# EAGLE design SparkFun_quadstep-v11assembly (EAGLE 5.06)
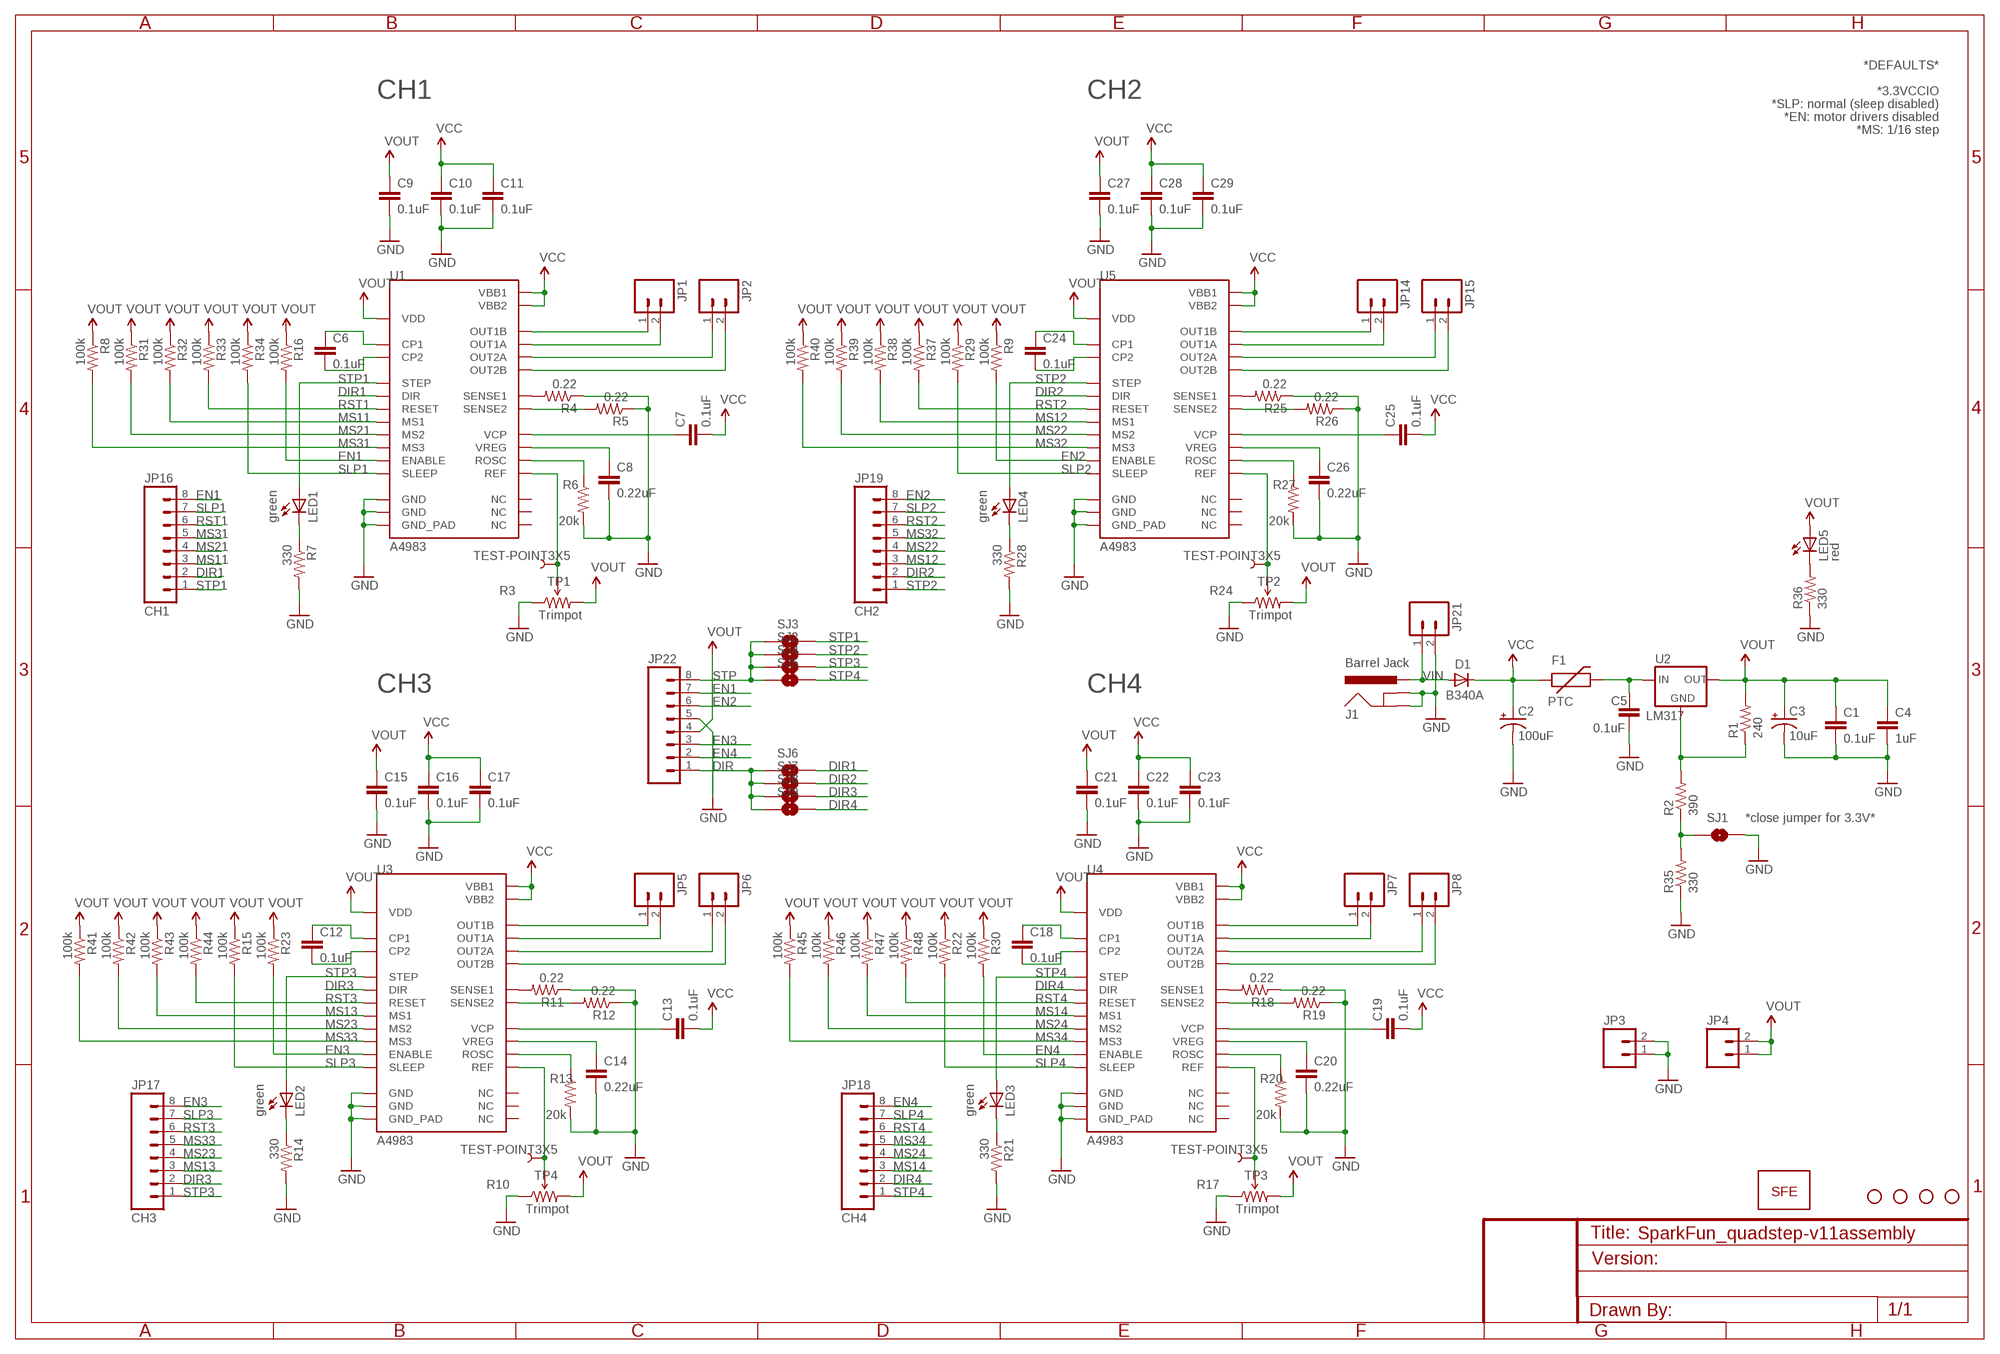
[diagram p0: schematic, sheet 1]

## Parts
C1  0.1uF  CAP0402-CAP  [0402-CAP]
C2  100uF  CAP_POLG  [PANASONIC_G]
C3  10uF  CAP_POL1206  [EIA3216]
C4  1uF  CAP0805  [0805]
C5  0.1uF  CAP0402-CAP  [0402-CAP]
C6  0.1uF  CAP0402-CAP  [0402-CAP]
C7  0.1uF  CAP0402-CAP  [0402-CAP]
C8  0.22uF  CAP0402-CAP  [0402-CAP]
C9  0.1uF  CAP0402-CAP  [0402-CAP]
C10  0.1uF  CAP0402-CAP  [0402-CAP]
C11  0.1uF  CAP0402-CAP  [0402-CAP]
C12  0.1uF  CAP0402-CAP  [0402-CAP]
C13  0.1uF  CAP0402-CAP  [0402-CAP]
C14  0.22uF  CAP0402-CAP  [0402-CAP]
C15  0.1uF  CAP0402-CAP  [0402-CAP]
C16  0.1uF  CAP0402-CAP  [0402-CAP]
C17  0.1uF  CAP0402-CAP  [0402-CAP]
C18  0.1uF  CAP0402-CAP  [0402-CAP]
C19  0.1uF  CAP0402-CAP  [0402-CAP]
C20  0.22uF  CAP0402-CAP  [0402-CAP]
C21  0.1uF  CAP0402-CAP  [0402-CAP]
C22  0.1uF  CAP0402-CAP  [0402-CAP]
C23  0.1uF  CAP0402-CAP  [0402-CAP]
C24  0.1uF  CAP0402-CAP  [0402-CAP]
C25  0.1uF  CAP0402-CAP  [0402-CAP]
C26  0.22uF  CAP0402-CAP  [0402-CAP]
C27  0.1uF  CAP0402-CAP  [0402-CAP]
C28  0.1uF  CAP0402-CAP  [0402-CAP]
C29  0.1uF  CAP0402-CAP  [0402-CAP]
D1  B340A  DIODESMA  [SMA-DIODE]
F1  PTC  PTCSMD  [PTC-1206]
J1  Barrel Jack  POWER_JACKSMD  [POWER_JACK_SMD]
JP1  M023.5MM_LOCK  [SCREWTERMINAL-3.5MM-2_LOCK]
JP2  M023.5MM_LOCK  [SCREWTERMINAL-3.5MM-2_LOCK]
JP3  M02PTH  [1X02]
JP4  M02PTH  [1X02]
JP5  M023.5MM_LOCK  [SCREWTERMINAL-3.5MM-2_LOCK]
JP6  M023.5MM_LOCK  [SCREWTERMINAL-3.5MM-2_LOCK]
JP7  M023.5MM_LOCK  [SCREWTERMINAL-3.5MM-2_LOCK]
JP8  M023.5MM_LOCK  [SCREWTERMINAL-3.5MM-2_LOCK]
JP9  STAND-OFF  [STAND-OFF]
JP10  STAND-OFF  [STAND-OFF]
JP11  STAND-OFF  [STAND-OFF]
JP12  STAND-OFF  [STAND-OFF]
JP14  M023.5MM_LOCK  [SCREWTERMINAL-3.5MM-2_LOCK]
JP15  M023.5MM_LOCK  [SCREWTERMINAL-3.5MM-2_LOCK]
JP16  CH1  M08  [1X08]
JP17  CH3  M08  [1X08]
JP18  CH4  M08  [1X08]
JP19  CH2  M08  [1X08]
JP20  LOGO-SFENEW  [SFE-NEW-WEBLOGO]
JP21  M02PTH  [1X02]
JP22  M08  [1X08]
LED1  green  LED0603  [LED-0603]
LED2  green  LED0603  [LED-0603]
LED3  green  LED0603  [LED-0603]
LED4  green  LED0603  [LED-0603]
LED5  red  LED0603  [LED-0603]
R1  240  RESISTOR0402-RES  [0402-RES]
R2  390  RESISTOR0402-RES  [0402-RES]
R3  Trimpot  TRIMPOTSMD  [TRIMPOT-3MM]
R4  0.22  RESISTOR0805-RES  [0805]
R5  0.22  RESISTOR0805-RES  [0805]
R6  20k  RESISTOR0402-RES  [0402-RES]
R7  330  RESISTOR0402-RES  [0402-RES]
R8  100k  RESISTOR0402-RES  [0402-RES]
R9  100k  RESISTOR0402-RES  [0402-RES]
R10  Trimpot  TRIMPOTSMD  [TRIMPOT-3MM]
R11  0.22  RESISTOR0805-RES  [0805]
R12  0.22  RESISTOR0805-RES  [0805]
R13  20k  RESISTOR0402-RES  [0402-RES]
R14  330  RESISTOR0402-RES  [0402-RES]
R15  100k  RESISTOR0402-RES  [0402-RES]
R16  100k  RESISTOR0402-RES  [0402-RES]
R17  Trimpot  TRIMPOTSMD  [TRIMPOT-3MM]
R18  0.22  RESISTOR0805-RES  [0805]
R19  0.22  RESISTOR0805-RES  [0805]
R20  20k  RESISTOR0402-RES  [0402-RES]
R21  330  RESISTOR0402-RES  [0402-RES]
R22  100k  RESISTOR0402-RES  [0402-RES]
R23  100k  RESISTOR0402-RES  [0402-RES]
R24  Trimpot  TRIMPOTSMD  [TRIMPOT-3MM]
R25  0.22  RESISTOR0805-RES  [0805]
R26  0.22  RESISTOR0805-RES  [0805]
R27  20k  RESISTOR0402-RES  [0402-RES]
R28  330  RESISTOR0402-RES  [0402-RES]
R29  100k  RESISTOR0402-RES  [0402-RES]
R30  100k  RESISTOR0402-RES  [0402-RES]
R31  100k  RESISTOR0402-RES  [0402-RES]
R32  100k  RESISTOR0402-RES  [0402-RES]
R33  100k  RESISTOR0402-RES  [0402-RES]
R34  100k  RESISTOR0402-RES  [0402-RES]
R35  330  RESISTOR0402-RES  [0402-RES]
R36  330  RESISTOR0402-RES  [0402-RES]
R37  100k  RESISTOR0402-RES  [0402-RES]
R38  100k  RESISTOR0402-RES  [0402-RES]
R39  100k  RESISTOR0402-RES  [0402-RES]
R40  100k  RESISTOR0402-RES  [0402-RES]
R41  100k  RESISTOR0402-RES  [0402-RES]
R42  100k  RESISTOR0402-RES  [0402-RES]
R43  100k  RESISTOR0402-RES  [0402-RES]
R44  100k  RESISTOR0402-RES  [0402-RES]
R45  100k  RESISTOR0402-RES  [0402-RES]
R46  100k  RESISTOR0402-RES  [0402-RES]
R47  100k  RESISTOR0402-RES  [0402-RES]
R48  100k  RESISTOR0402-RES  [0402-RES]
SJ1  SOLDERJUMPERNO  [SJ_2S-NO]
SJ2  SOLDERJUMPERNO  [SJ_2S-NO]
SJ3  SOLDERJUMPERNO  [SJ_2S-NO]
SJ4  SOLDERJUMPERNO  [SJ_2S-NO]
SJ5  SOLDERJUMPERNO  [SJ_2S-NO]
SJ6  SOLDERJUMPERNO  [SJ_2S-NO]
SJ7  SOLDERJUMPERNO  [SJ_2S-NO]
SJ8  SOLDERJUMPERNO  [SJ_2S-NO]
SJ9  SOLDERJUMPERNO  [SJ_2S-NO]
TP1  TEST-POINT3X5  [PAD.03X.05]
TP2  TEST-POINT3X5  [PAD.03X.05]
TP3  TEST-POINT3X5  [PAD.03X.05]
TP4  TEST-POINT3X5  [PAD.03X.05]
U1  A4983  [QFN-28-5MM]
U2  LM317  V_REG_MC33269DT  [DPAK]
U3  A4983  [QFN-28-5MM]
U4  A4983  [QFN-28-5MM]
U5  A4983  [QFN-28-5MM]

## Nets
DIR: JP22.1 SJ6.1 SJ7.1 SJ8.1 SJ9.1
DIR1: JP16.2 SJ6.2 U1.P$19(DIR)
DIR2: JP19.2 SJ7.2 U5.P$19(DIR)
DIR3: JP17.2 SJ8.2 U3.P$19(DIR)
DIR4: JP18.2 SJ9.2 U4.P$19(DIR)
EN1: JP16.8 JP22.7 R16.2 U1.P$2(ENABLE)
EN2: JP19.8 JP22.6 R9.2 U5.P$2(ENABLE)
EN3: JP17.8 JP22.3 R23.2 U3.P$2(ENABLE)
EN4: JP18.8 JP22.2 R30.2 U4.P$2(ENABLE)
GND: C1.2 C2.- C3.C(-) C4.2 C5.2 C8.2 C9.2 C10.2 C11.2 C14.2 C15.2 C16.2 C17.2 C20.2 C21.2 C22.2 C23.2 C26.2 C27.2 C28.2 C29.2 J1.GND(GNDBREAK) J1.P$4(GND) JP3.1 JP3.2 JP21.2 JP22.5 R3.1(CCW) R4.1 R5.1 R6.2 R7.2 R10.1(CCW) R11.1 R12.1 R13.2 R14.2 R17.1(CCW) R18.1 R19.1 R20.2 R21.2 R24.1(CCW) R25.1 R26.1 R27.2 R28.2 R35.1 R36.1 SJ1.2 U1.P$3(GND) U1.P$18(GND) U1.P$29(GND_PAD) U3.P$3(GND) U3.P$18(GND) U3.P$29(GND_PAD) U4.P$3(GND) U4.P$18(GND) U4.P$29(GND_PAD) U5.P$3(GND) U5.P$18(GND) U5.P$29(GND_PAD)
MS11: JP16.3 R32.2 U1.P$9(MS1)
MS12: JP19.3 R38.2 U5.P$9(MS1)
MS13: JP17.3 R43.2 U3.P$9(MS1)
MS14: JP18.3 R47.2 U4.P$9(MS1)
MS21: JP16.4 R31.2 U1.P$10(MS2)
MS22: JP19.4 R39.2 U5.P$10(MS2)
MS23: JP17.4 R42.2 U3.P$10(MS2)
MS24: JP18.4 R46.2 U4.P$10(MS2)
MS31: JP16.5 R8.2 U1.P$11(MS3)
MS32: JP19.5 R40.2 U5.P$11(MS3)
MS33: JP17.5 R41.2 U3.P$11(MS3)
MS34: JP18.5 R45.2 U4.P$11(MS3)
N$1: R1.1 R2.2 U2.1(GND)
N$2: JP1.1 U1.P$21(OUT1B)
N$3: JP1.2 U1.P$24(OUT1A)
N$4: C5.1 F1.2 U2.3(IN)
N$6: JP2.1 U1.P$26(OUT2A)
N$7: JP2.2 U1.P$1(OUT2B)
N$8: R4.2 U1.P$23(SENSE1)
N$9: R5.2 U1.P$27(SENSE2)
N$10: C7.1 U1.P$6(VCP)
N$11: C8.1 U1.P$8(VREG)
N$12: R6.1 U1.P$13(ROSC)
N$13: C6.1 U1.P$4(CP1)
N$14: R3.2(WIPER) TP1.P$1 U1.P$17(REF)
N$15: C6.2 U1.P$5(CP2)
N$16: R11.2 U3.P$23(SENSE1)
N$17: LED1.C R7.1
N$18: R12.2 U3.P$27(SENSE2)
N$19: C13.1 U3.P$6(VCP)
N$20: C14.1 U3.P$8(VREG)
N$21: R13.1 U3.P$13(ROSC)
N$22: R10.2(WIPER) TP4.P$1 U3.P$17(REF)
N$23: C12.1 U3.P$4(CP1)
N$24: R2.1 R35.2 SJ1.1
N$25: C12.2 U3.P$5(CP2)
N$26: LED2.C R14.1
N$27: LED5.C R36.2
N$28: JP5.1 U3.P$21(OUT1B)
N$29: JP5.2 U3.P$24(OUT1A)
N$30: JP6.1 U3.P$26(OUT2A)
N$31: JP6.2 U3.P$1(OUT2B)
N$32: R18.2 U4.P$23(SENSE1)
N$33: R19.2 U4.P$27(SENSE2)
N$34: C19.1 U4.P$6(VCP)
N$35: C20.1 U4.P$8(VREG)
N$36: R20.1 U4.P$13(ROSC)
N$37: R17.2(WIPER) TP3.P$1 U4.P$17(REF)
N$38: C18.1 U4.P$4(CP1)
N$39: C18.2 U4.P$5(CP2)
N$40: LED3.C R21.1
N$41: JP7.1 U4.P$21(OUT1B)
N$42: JP7.2 U4.P$24(OUT1A)
N$43: JP8.1 U4.P$26(OUT2A)
N$44: JP8.2 U4.P$1(OUT2B)
N$45: R25.2 U5.P$23(SENSE1)
N$46: R26.2 U5.P$27(SENSE2)
N$47: C25.1 U5.P$6(VCP)
N$48: C26.1 U5.P$8(VREG)
N$49: R27.1 U5.P$13(ROSC)
N$50: R24.2(WIPER) TP2.P$1 U5.P$17(REF)
N$51: C24.1 U5.P$4(CP1)
N$52: C24.2 U5.P$5(CP2)
N$53: LED4.C R28.1
N$54: JP14.1 U5.P$21(OUT1B)
N$55: JP14.2 U5.P$24(OUT1A)
N$56: JP15.1 U5.P$26(OUT2A)
N$57: JP15.2 U5.P$1(OUT2B)
RST1: JP16.6 R33.2 U1.P$12(RESET)
RST2: JP19.6 R37.2 U5.P$12(RESET)
RST3: JP17.6 R44.2 U3.P$12(RESET)
RST4: JP18.6 R48.2 U4.P$12(RESET)
SLP1: JP16.7 R34.2 U1.P$14(SLEEP)
SLP2: JP19.7 R29.2 U5.P$14(SLEEP)
SLP3: JP17.7 R15.2 U3.P$14(SLEEP)
SLP4: JP18.7 R22.2 U4.P$14(SLEEP)
STP: JP22.8 SJ2.1 SJ3.1 SJ4.1 SJ5.1
STP1: JP16.1 LED1.A SJ3.2 U1.P$16(STEP)
STP2: JP19.1 LED4.A SJ2.2 U5.P$16(STEP)
STP3: JP17.1 LED2.A SJ4.2 U3.P$16(STEP)
STP4: JP18.1 LED3.A SJ5.2 U4.P$16(STEP)
VCC: C2.+ C7.2 C10.1 C11.1 C13.2 C16.1 C17.1 C19.2 C22.1 C23.1 C25.2 C28.1 C29.1 D1.C F1.1 U1.P$22(VBB1) U1.P$28(VBB2) U3.P$22(VBB1) U3.P$28(VBB2) U4.P$22(VBB1) U4.P$28(VBB2) U5.P$22(VBB1) U5.P$28(VBB2)
VIN: D1.A J1.VIN0(PWR) JP21.1
VOUT: C1.1 C3.A(+) C4.1 C9.1 C15.1 C21.1 C27.1 JP4.1 JP4.2 JP22.4 LED5.A R1.2 R3.3(CW) R8.1 R9.1 R10.3(CW) R15.1 R16.1 R17.3(CW) R22.1 R23.1 R24.3(CW) R29.1 R30.1 R31.1 R32.1 R33.1 R34.1 R37.1 R38.1 R39.1 R40.1 R41.1 R42.1 R43.1 R44.1 R45.1 R46.1 R47.1 R48.1 U1.P$15(VDD) U2.4(OUT) U3.P$15(VDD) U4.P$15(VDD) U5.P$15(VDD)
Unconnected: U1.P$7(NC) U1.P$20(NC) U1.P$25(NC) U3.P$7(NC) U3.P$20(NC) U3.P$25(NC) U4.P$7(NC) U4.P$20(NC) U4.P$25(NC) U5.P$7(NC) U5.P$20(NC) U5.P$25(NC)

## Notes on the sheet
- *DEFAULTS*
- *3.3VCCIO
- CH1 | CH2 | *SLP: normal (sleep disabled)
- *EN: motor drivers disabled
- *MS: 1/16 step
- CH3 | CH4
- *close jumper for 3.3V*

## Library data of the parts
C1 C4-C29 = SparkFun:CAP: Capacitor Standard 0603 ceramic capacitor, and 0.1" leaded capacitor.
C2 C3 = SparkFun:CAP_POL: Capacitor Polarized These are standard SMD and PTH capacitors. Normally 10uF, 47uF, and 100uF in electrolytic and tantalum varieties. Always verify the external diameter of the through hole cap, it varies with capacity, voltage, and manufacturer. The EIA devices should be standard.
D1 = SparkFun:DIODE: Diode These are standard reverse protection diodes and small signal diodes. SMA package can handle up to about 1A. SOD-323 can handle about 200mA. What the SOD-323 package when ordering, there are some mfgs out there that are 5-pin packages.
F1 = SparkFun:PTC: Resettable Fuse PTC Resettable Fuse. Spark Fun Electronics SKU : COM-08357
J1 = SparkFun:POWER_JACK: Power Jack This is the standard 5.5mm barrel jack for power. The PTH is the most common, proven, reliable, footprint. All others are experimental. The Slot footprint only works if the mill layer is transmitted to the PCB fab house so be warned. Spark Fun Electronics SKU : PRT-00119. Mating wall wart : TOL-00298 (and others)
JP1-JP8 JP14 JP15 JP21 = SparkFun:M02: Header 2 Standard 2-pin 0.1" header. Use with straight break away headers (SKU : PRT-00116), right angle break away headers (PRT-00553), swiss pins (PRT-00743), machine pins (PRT-00117), and female headers (PRT-00115). Molex polarized connector foot print use with SKU : PRT-08233 with associated crimp pins and housings.
JP9-JP12 = SparkFun:STAND-OFF: Stand Off This is the mechanical footprint for a #4 phillips button head screw. Use the keepout ring to avoid running the screw head into surrounding components. SKU : PRT-00447
JP16-JP19 JP22 = SparkFun:M08: Header 8 Standard 8-pin 0.1" header. Use with straight break away headers (SKU : PRT-00116), right angle break away headers (PRT-00553), swiss pins (PRT-00743), machine pins (PRT-00117), and female headers (PRT-00115).
JP20 = SparkFun:LOGO-SFE: Spark Fun Electronics PCB Logo This is the standard Spark Fun Electronics PCB logo.
LED1-LED5 = SparkFun:LED: LEDs Standard schematic elements and footprints for 5mm, 3mm, 1206, and 0603 sized LEDs. 5mm - Spark Fun Electronics SKU : COM-00529 (and others)
R1 R2 R4-R9 R11-R16 R18-R23 R25-R48 = SparkFun:RESISTOR: Resistor Basic schematic elements and footprints for 0603, 1206, and PTH resistors.
R3 R10 R17 R24 = SparkFun:TRIMPOT
SJ1-SJ9 = SparkFun:SOLDERJUMPER: Solder Jumper Standard SMD solder jumper. Used to automate production. Two varients : Normally Open and Normally Closed are the same, but have different paste layers. NC will have a large amount of paste and should jumper during reflow.
TP1-TP4 = SparkFun:TEST-POINT
U1 U3-U5 = SparkFun:A4983: DMOS Microstepping Driver with Translator
U2 = SparkFun:V_REG_MC33269

## Board
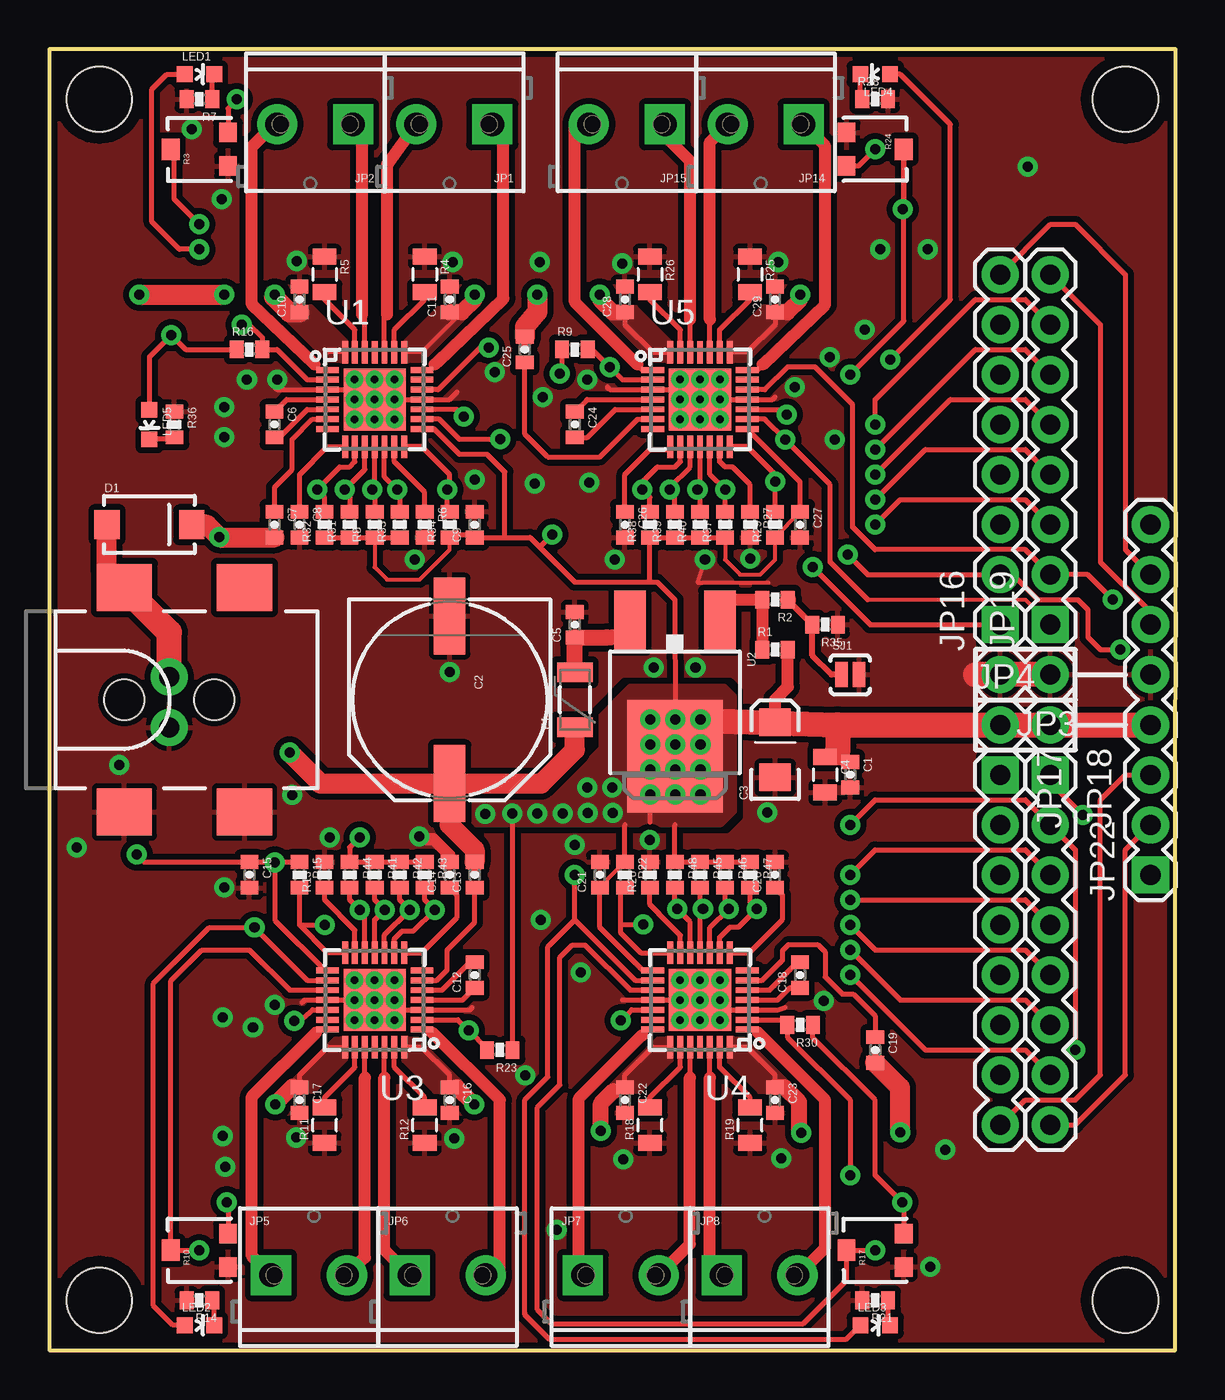
[diagram p1: board, top side]
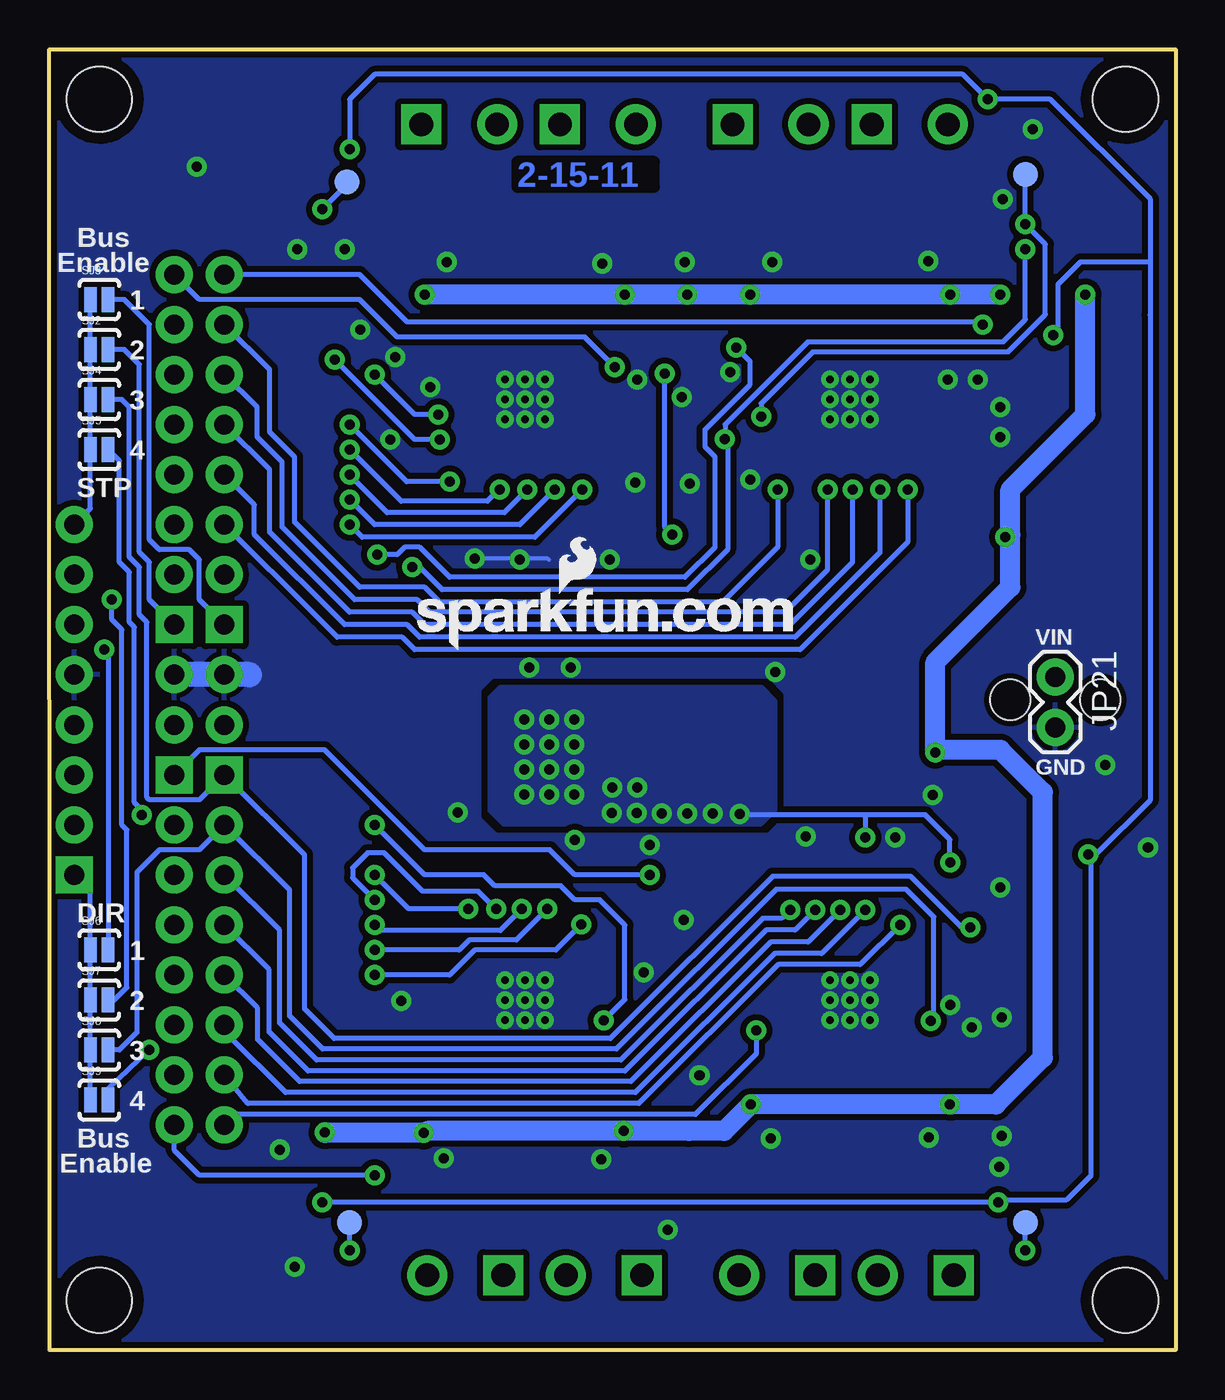
[diagram p2: board, bottom side, seen from below]

Size 57.15 x 66.04 mm. Coordinates in mm from the lower left corner, seen from the top.
Outline: 0,0 57.13,0 57.15,66.04 0,66.04 0,0
Copper layers (1*16): Top 0.035mm / dielectric 1.5mm / Bottom 0.035mm
Design rules "SparkFun": minimum track width 8mil, minimum drill 20mil, track to track 8mil, track to pad 8mil, pad to pad 8mil, via to via 8mil, smd to smd 8mil, copper to edge 8mil, drill to drill 8mil, minimum pad ring 12mil, minimum via ring 10mil, stop-mask expansion 4mil, vias tented up to drill 20mil, thermal gap 10mil

### Footprints (pad centres in the part's own frame; a part is rotated, then mirrored left to right if it is on the bottom)
0402-CAP = smd 0.7 x 0.9: 1 -0.65,0; 2 0.65,0
PANASONIC_G = smd 3.9 x 1.6: + 4.25,0; - -4.25,0
EIA3216 = smd 1.4 x 1.6: A 1.4,0; C -1.4,0
0805 = smd 0.8 x 1.2: 1 -0.9,0; 2 0.9,0
SMA-DIODE = smd 1.27 x 1.47: A -2.15,0; C 2.15,0
PTC-1206 = smd 1 x 1.8: 1 -1.4,0; 2 1.4,0
POWER_JACK_SMD = smd 2.8 x 2.4: GND 0,-5.7; P$4 6.1,-5.7; VIN0 0,5.7; VIN1 6.1,5.7 | hole 2.032: 0,0; 4.572,0
SCREWTERMINAL-3.5MM-2_LOCK = drill 1.2 pad 2.032 square: 1 -0.178,0 | drill 1.2 pad 2.032 round: 2 3.678,0
1X02 = drill 1.016 pad 1.88 round: 1 0,0; 2 2.54,0
STAND-OFF = hole 3.302: 0,0
1X08 = drill 1.016 pad 1.88 square: 1 0,0 | drill 1.016 pad 1.88 round: 2 2.54,0; 3 5.08,0; 4 7.62,0; 5 10.16,0; 6 12.7,0; 7 15.24,0; 8 17.78,0
LED-0603 = smd 0.8 x 0.8: A 0,-0.75; C 0,0.75
0402-RES = smd 0.7 x 0.9: 1 -0.65,0; 2 0.65,0
TRIMPOT-3MM = smd 1 x 0.9: 1 -0.85,-1.45; 3 0.85,-1.45 | smd 1.1 x 0.9: 2 0,1.45
SJ_2S-NO = smd 0.635 x 1.27: 1 -0.45,0; 2 0.45,0
PAD.03X.05 = smd 1.27 x 1.27: P$1 0,0
QFN-28-5MM = smd 1.15 x 0.3: P$1 -2.4,1.5; P$2 -2.4,1; P$3 -2.4,0.5; P$4 -2.4,0; P$5 -2.4,-0.5; P$6 -2.4,-1; P$7 -2.4,-1.5; P$15 2.4,-1.5; P$16 2.4,-1; P$17 2.4,-0.5; P$18 2.4,0; P$19 2.4,0.5; P$20 2.4,1; P$21 2.4,1.5 | smd 0.3 x 1.15: P$8 -1.5,-2.4; P$9 -1,-2.4; P$10 -0.5,-2.4; P$11 0,-2.4; P$12 0.5,-2.4; P$13 1,-2.4; P$14 1.5,-2.4; P$22 1.5,2.4; P$23 1,2.4; P$24 0.5,2.4; P$25 0,2.4; P$26 -0.5,2.4; P$27 -1,2.4; P$28 -1.5,2.4 | smd 3.15 x 3.15: P$29 0,0
DPAK = smd 1.6 x 3: 1 -2.28,-5.31; 3 2.28,-5.31 | smd 4.826 x 5.715: 4 0,1.588

### Placement (x,y rotation side)
C1  40.64,29.21 270 top
C2  20.32,33.02 270 top
C3  36.83,30.48 90 top
C4  39.37,29.21 270 top
C5  26.67,36.83 90 top
C6  11.43,46.99 270 top
C7  11.43,41.91 270 top
C8  12.7,41.91 270 top
C9  21.59,41.91 90 top
C10  12.7,53.34 90 top
C11  20.32,53.34 90 top
C12  21.59,19.05 90 top
C13  21.59,24.13 90 top
C14  20.32,24.13 90 top
C15  10.16,24.13 270 top
C16  20.32,12.7 270 top
C17  12.7,12.7 270 top
C18  38.1,19.05 90 top
C19  41.91,15.24 270 top
C20  36.83,24.13 90 top
C21  27.94,24.13 90 top
C22  29.21,12.7 270 top
C23  36.83,12.7 270 top
C24  26.67,46.99 270 top
C25  24.13,50.8 90 top
C26  29.21,41.91 270 top
C27  38.1,41.91 270 top
C28  29.21,53.34 90 top
C29  36.83,53.34 90 top
D1  5.08,41.91 0 top
F1  26.67,33.02 90 top
J1  3.81,33.02 0 top
JP1  22.3,62.23 180 top
JP2  15.24,62.23 180 top
JP3  50.8,34.29 180 top
JP4  48.26,31.75 0 top
JP5  11.43,3.81 0 top
JP6  18.47,3.81 0 top
JP7  27.25,3.81 0 top
JP8  34.29,3.81 0 top
JP9  2.54,2.54 0 top
JP10  54.61,2.54 0 top
JP11  2.54,63.5 0 top
JP12  54.61,63.5 0 top
JP14  38.1,62.23 180 top
JP15  31.06,62.23 180 top
JP16  48.26,36.83 90 top
JP17  48.26,29.21 270 top
JP18  50.8,29.21 270 top
JP19  50.8,36.83 90 top
JP20  38.48,35.56 0 bottom
JP21  6.1,34.16 270 bottom
JP22  55.88,24.13 90 top
LED1  7.62,64.77 270 top
LED2  7.62,1.27 270 top
LED3  41.91,1.27 270 top
LED4  41.91,64.77 90 top
LED5  5.08,46.99 180 top
R1  36.83,35.56 0 top
R2  36.83,38.1 180 top
R3  7.62,60.96 90 top
R4  19.05,54.61 270 top
R5  13.97,54.61 270 top
R6  19.05,41.91 270 top
R7  7.62,63.5 180 top
R8  16.51,41.91 90 top
R9  26.67,50.8 0 top
R10  7.62,5.08 90 top
R11  13.97,11.43 90 top
R12  19.05,11.43 90 top
R13  13.97,24.13 90 top
R14  7.62,2.54 180 top
R15  12.7,24.13 270 top
R16  10.16,50.8 0 top
R17  41.91,5.08 90 top
R18  30.48,11.43 90 top
R19  35.56,11.43 90 top
R20  30.48,24.13 90 top
R21  41.91,2.54 180 top
R22  29.21,24.13 270 top
R23  22.86,15.24 180 top
R24  41.91,60.96 270 top
R25  35.56,54.61 270 top
R26  30.48,54.61 270 top
R27  35.56,41.91 270 top
R28  41.91,63.5 0 top
R29  36.83,41.91 90 top
R30  38.1,16.51 180 top
R31  15.24,41.91 90 top
R32  13.97,41.91 90 top
R33  17.78,41.91 90 top
R34  20.32,41.91 90 top
R35  39.37,36.83 180 top
R36  6.35,46.99 270 top
R37  34.29,41.91 90 top
R38  30.48,41.91 90 top
R39  31.75,41.91 90 top
R40  33.02,41.91 90 top
R41  16.51,24.13 270 top
R42  17.78,24.13 270 top
R43  19.05,24.13 270 top
R44  15.24,24.13 270 top
R45  33.02,24.13 270 top
R46  34.29,24.13 270 top
R47  35.56,24.13 270 top
R48  31.75,24.13 270 top
SJ1  40.64,34.29 0 top
SJ2  54.61,50.8 0 bottom
SJ3  54.61,53.34 0 bottom
SJ4  54.61,48.26 0 bottom
SJ5  54.61,45.72 0 bottom
SJ6  54.61,20.32 0 bottom
SJ7  54.61,17.78 0 bottom
SJ8  54.61,15.24 0 bottom
SJ9  54.61,12.7 0 bottom
TP1  7.62,59.69 0 bottom
TP2  42.04,59.31 0 bottom
TP3  41.91,6.48 0 bottom
TP4  7.62,6.48 0 bottom
U1  16.51,48.26 0 top
U2  31.75,31.75 180 top
U3  16.51,17.78 180 top
U4  33.02,17.78 180 top
U5  33.02,48.26 0 top

### Tracks (layer width: path | path; a pad name or v marks a point on that pad's centre or on a via)
DIR
  Bottom 0.254: SJ9.1 SJ8.1 SJ7.1 SJ6.1 55.06,23.31 JP22.1
DIR1  (via drill 0.51)
  Top 0.254: U1.P$19 19.73,48.76 21.87,50.9 v22.3,50.9 | v40.51,40.39 41.53,39.37 JP16.2 48.9,39.37 50.16,38.1 52.2,38.1 52.7,37.59 52.7,36.2 53.34,35.56 v54.36,35.56
  Bottom 0.254: v40.51,40.39 39.5,40.39 39.12,40.77 38.35,40.77 36.83,39.24 24.89,39.24 23.37,40.77 23.37,45.34 23.88,45.85 23.88,46.74 21.59,49.02 21.59,50.19 v22.3,50.9 | SJ6.2 54.16,35.49 v54.36,35.56
DIR2  (via drill 0.51)
  Top 0.254: U5.P$19 36.31,48.76 37.47,49.91 38.86,49.91 40.77,48.01 40.77,41.78 41.91,40.64 49.53,40.64 JP19.2 52.7,39.37 v53.98,38.1
  Bottom 0.254: SJ7.2 53.85,17.78 53.21,18.41 53.21,26.42 53.47,26.67 53.47,36.58 53.98,37.08 v53.98,38.1
DIR3  (via drill 0.51)
  Top 0.254: U3.P$19 13.37,17.28 12.72,16.74 v12.42,16.71
  Bottom 0.254: v12.42,16.71 12.27,16.87 12.27,22 13.66,23.39 20.27,23.39 28.37,15.29 43.28,15.29 44.96,16.97 44.96,23.37 JP17.2 49.53,25.4 51.56,25.4 52.7,24.26 52.7,16.13 53.59,15.24 SJ8.2
DIR4  (via drill 0.51)
  Top 0.254: v40.64,26.67 41.91,27.94 49.53,27.94 JP18.2 52.07,25.4 v52.07,15.24 | U4.P$19 29.55,17.28 v29.01,16.74
  Bottom 0.254: v40.64,26.67 38.1,24.13 35.1,24.13 34.54,23.57 31.19,23.57 30.48,22.86 29.21,22.86 27.94,21.59 27.94,17.8 v29.01,16.74 | SJ9.2 54.16,13.28 v52.07,15.24
EN1  (via drill 0.51)
  Top 0.254: v9.78,52.07 10.16,52.07 10.81,51.42 R16.2 11.56,50.8 13.1,49.26 U1.P$2 | JP22.7 54.61,40.64 54.61,54.61 52.07,57.15 50.8,57.15 JP16.8
  Bottom 0.254: JP16.8 41.4,54.61 38.99,52.2 9.91,52.2 v9.78,52.07
EN2  (via drill 0.51)
  Top 0.254: U5.P$2 29.1,49.26 v28.45,49.91 27.56,50.8 R9.2 | JP19.8 53.34,52.07 53.34,40.01 55.63,37.72 55.63,37.08 JP22.6
  Bottom 0.254: JP19.8 49.53,53.34 41.4,53.34 39.5,51.44 29.97,51.44 v28.45,49.91
EN3  (via drill 0.51)
  Top 0.254: U3.P$2 20.74,16.78 v21.29,16.23 22.21,15.31 R23.2 | JP22.3 54.61,29.21 53.34,27.94 53.34,13.97 52.07,12.7 49.53,12.7 JP17.8
  Bottom 0.254: JP17.8 47.73,11.96 24.36,11.96 21.29,15.04 v21.29,16.23
EN4  (via drill 0.51)
  Top 0.254: v40.64,8.89 40.64,12.7 37.45,15.89 R30.2 37.18,16.78 U4.P$2 | JP22.2 54.61,25.4 54.61,13.97 52.07,11.43 JP18.8
  Bottom 0.254: JP18.8 50.8,10.16 49.53,8.89 v40.64,8.89
GND  (via drill 0.38, 0.51)
  Top 0.203: 36.5,38.96 32.92,38.96 v33.27,40.13 | 18.92,17.27 U3.P$3 | 30.48,17.78 U4.P$18
  Top 0.254: 31.61,48.76 31.62,48.77 | 31.61,48.76 32.52,48.76 U5.P$29 U5.P$18 | U5.P$3 31.61,48.76 | U1.P$3 16.01,48.76 U1.P$29 U1.P$18 | U4.P$18 U4.P$29 33.52,17.28 U4.P$3 | U3.P$18 U3.P$29 17.01,17.28 U3.P$3 | 14.1,48.77 11.56,48.77 11.43,48.9 | 19.05,48.26 20.32,48.26 20.7,48.64 | 30.61,48.77 28.45,48.77 28.32,48.9 | 35.43,48.26 36.7,48.26 36.83,48.39 | 14.1,17.78 12.95,17.78 12.83,17.65 | 18.92,17.27 21.34,17.27 21.46,17.4 | 29.08,17.78 30.48,17.78 30.61,17.78 | 35.43,17.27 36.96,17.27 37.34,17.4
  Top 0.61: C14.2 20.32,25.12 19.51,25.93 18.92,25.93 v18.77,26.09
  Top 1.27: JP3.1 46.99,34.29
  Bottom 0.203: v35.56,40.18 31.85,40.18 31.8,40.13
  Bottom 1.27: 46.99,34.29 JP3.1
  other vias: 32,49.28 33.02,49.28 34.04,49.28 32,48.26 33.02,48.26 34.04,48.26 32,47.24 33.02,47.24 34.04,47.24 15.49,49.28 16.51,49.28 17.53,49.28 15.49,48.26 16.51,48.26 17.53,48.26 15.49,47.24 16.51,47.24 17.53,47.24 32,18.8 33.02,18.8 34.04,18.8 32,17.78 33.02,17.78 34.04,17.78 32,16.76 33.02,16.76 34.04,16.76 15.49,18.8 16.51,18.8 17.53,18.8 15.49,17.78 16.51,17.78 17.53,17.78 15.49,16.76 16.51,16.76 17.53,16.76 29.08,55.17 12.55,55.3 36.98,55.24 20.47,55.24 29.13,9.7 27.3,49.28 18.54,40.13 41.38,51.82 8.76,58.42 7.24,61.98 21.59,44.2 14.22,26.04 30.48,25.91 8.89,23.5 11.43,17.53 26.67,25.65 20.55,10.74 36.42,27.3 24.94,21.84 44.7,4.24 39.29,17.73 8.89,47.88 22.61,49.66 28.7,40.13 8.89,46.35 25.04,48.39 24.64,43.99 27.41,44.04 37.82,48.9 39.85,46.23 39.6,50.42 24.89,55.24 42.16,55.88 44.58,55.88 49.66,60.07 11.56,49.28 10.03,49.28 20.32,34.42 8.81,16.89 26.97,19.18 24.16,13.94 25.76,6.12 45.47,10.19 10.34,16.38 3.56,29.72 12.32,28.19 1.4,25.53 30.68,34.65 32.79,34.65 8.94,9.32 8.81,10.87 12.52,10.79 37.13,9.75
  pour Bottom (isolate 0.305, rank 2): 0,66.04 0,0 57.15,0 57.15,66.04
  pour Top (isolate 0.305, rank 2): 0,66.04 0,0 57.15,0 57.15,66.04
MS11  (via drill 0.51)
  Top 0.254: U1.P$9 15.51,45.1 15.24,44.83 14.73,44.83 v13.59,43.69 13.97,43.31 R32.2
  Bottom 0.254: v13.59,43.69 13.59,41.02 19.05,35.56 38.61,35.56 39.24,36.2 42.55,36.2 43.18,36.83 43.56,37.21 JP16.3
MS12  (via drill 0.51)
  Top 0.254: U5.P$9 32.02,45.1 31.75,44.83 30.86,44.83 30.1,44.07 v30.1,43.69 30.48,43.31 R38.2 | JP19.3 49.53,43.18 43.18,43.18 v41.91,41.91
  Bottom 0.254: v41.91,41.91 41.27,41.27 32.51,41.27 v30.1,43.69
MS13  (via drill 0.51)
  Top 0.254: U3.P$9 17.51,20.89 17.91,21.29 18.47,21.29 v19.56,22.35 19.05,22.86 R43.2
  Bottom 0.254: JP17.3 45.47,21.34 45.47,16.61 43.59,14.73 28.14,14.73 20.95,21.92 19.99,21.92 v19.56,22.35
MS14  (via drill 0.51)
  Top 0.254: U4.P$9 34.02,20.96 34.54,21.49 34.98,21.49 v35.89,22.4 35.56,22.73 R47.2 | JP18.3 49.53,25.4 41.91,25.4 v40.64,24.13
  Bottom 0.254: v35.89,22.4 38.91,22.4 v40.64,24.13
MS21  (via drill 0.51)
  Top 0.254: U1.P$10 16.01,44.71 v14.99,43.69 15.24,43.43 R31.2
  Bottom 0.254: v14.99,43.69 14.99,40.51 19.3,36.2 38.35,36.2 38.99,36.83 42.16,36.83 46.74,41.4 46.74,42.93 JP16.4
MS22  (via drill 0.51)
  Top 0.254: U5.P$10 32.52,44.84 31.5,43.81 v31.5,43.69 31.75,43.43 R39.2 | JP19.4 49.53,45.72 44.45,45.72 v41.91,43.18
  Bottom 0.254: v41.91,43.18 40.64,41.91 33.27,41.91 v31.5,43.69
MS23  (via drill 0.51)
  Top 0.254: U3.P$10 17.01,21.07 v18.29,22.35 17.78,22.86 R42.2
  Bottom 0.254: JP17.4 46,19.33 46,16.15 44.02,14.17 27.94,14.17 20.78,21.34 19.3,21.34 v18.29,22.35
MS24  (via drill 0.51)
  Top 0.254: U4.P$10 33.52,21.45 v34.47,22.4 34.29,22.58 R46.2 | JP18.4 49.53,22.86 v40.64,22.86
  Bottom 0.254: v34.47,22.4 34.49,22.4 35.38,23.29 38.2,23.29 40.16,25.25 41,25.25 41.76,24.49 41.76,23.98 v40.64,22.86
MS31  (via drill 0.51)
  Top 0.254: U1.P$11 16.51,43.81 v16.38,43.69 16.51,43.56 R8.2
  Bottom 0.254: v16.38,43.69 16.38,40.01 19.56,36.83 38.1,36.83 38.73,37.47 41.91,37.47 45.97,41.53 45.97,44.7 JP16.5
MS32  (via drill 0.51)
  Top 0.254: U5.P$11 33.02,43.81 v32.89,43.69 33.02,43.56 R40.2 | JP19.5 49.53,48.26 45.72,48.26 v41.91,44.45
  Bottom 0.254: v41.91,44.45 41.91,44.42 40.01,42.52 34.06,42.52 v32.89,43.69
MS33  (via drill 0.51)
  Top 0.254: U3.P$11 16.51,21.84 v17.02,22.35 16.51,22.86 R41.2
  Bottom 0.254: JP17.5 46.58,17.37 46.58,15.77 44.45,13.64 27.64,13.64 20.55,20.73 18.64,20.73 v17.02,22.35
MS34  (via drill 0.51)
  Top 0.254: U4.P$11 33.02,22.25 v33.17,22.4 33.02,22.55 R45.2 | JP18.5 49.53,20.32 41.91,20.32 v40.64,21.59
  Bottom 0.254: v40.64,21.59 40.62,21.59 40.34,21.31 34.27,21.31 v33.17,22.4
N$1
  Top 0.61: U2.1 34.29,37.32 34.29,38.1 R2.2 R1.1
N$2
  Top 0.254: U1.P$21 19.28,49.76 19.56,50.04
  Top 0.61: 19.56,50.04 19.68,50.15 23.04,53.39 23.04,61.67 JP1.1
N$3
  Top 0.254: U1.P$24 17.01,52.44 17.14,52.58
  Top 0.61: 17.14,52.58 17.14,60.19 JP1.2
N$4
  Top 0.813: F1.2 C5.1 28.31,36.18 29.72,36.32 29.72,36.81 U2.3
N$6
  Top 0.254: U1.P$26 16.01,52.44 15.88,52.58
  Top 0.61: 15.88,52.58 15.88,61.77 JP2.1
N$7
  Top 0.254: U1.P$1 13.74,49.76 13.46,50.04
  Top 0.61: JP2.2 11.43,62.23 10.29,61.09 10.29,53.09 13.46,50.04
N$8
  Top 0.254: U1.P$23 17.51,51.8 19.05,53.34 R4.2
N$9
  Top 0.254: U1.P$27 15.51,51.8 13.97,53.34 R5.2
N$10
  Top 0.254: U1.P$6 13.35,47.26 12.32,46.23 12.32,44.7 11.43,43.81 C7.1
N$11
  Top 0.254: U1.P$8 14.11,45.86 12.7,44.45 C8.1
N$12
  Top 0.254: U1.P$13 17.51,45.1 19.05,43.56 R6.1
N$13
  Top 0.254: U1.P$4 12.05,48.26 C6.1
N$14  (via drill 0.51)
  Top 0.254: R3.2 6.35,60.78 6.35,58.42 v7.62,57.15 | U1.P$17 20.67,47.76 v21.03,47.4
  Bottom 0.254: v21.03,47.4 21.03,48.06 18.41,50.67 8.51,50.67 6.6,52.58 6.6,56.13 v7.62,57.15 TP1.P$1
N$15
  Top 0.254: U1.P$5 13.09,47.76 11.67,46.34 C6.2
N$16
  Top 0.254: U3.P$23 15.51,14.37 13.97,12.83 R11.2
N$17
  Top 0.254: R7.1 8.27,64.67 LED1.C
N$18
  Top 0.254: U3.P$27 17.51,14.37 19.05,12.83 R12.2
N$19
  Top 0.254: U3.P$6 19.67,18.78 20.19,19.3 20.19,20.32 21.59,21.72 C13.1
N$20
  Top 0.254: U3.P$8 18.91,20.18 20.7,21.97 20.7,23.1 C14.1
N$21
  Top 0.254: U3.P$13 15.51,21.32 13.97,22.86 R13.1
N$22  (via drill 0.51)
  Top 0.254: U3.P$17 12.2,18.28 10.16,20.32 7.75,20.32 6.17,18.74 R10.2 v7.62,5.08
  Bottom 0.254: v7.62,5.08 TP4.P$1
N$23
  Top 0.254: U3.P$4 20.97,17.78 C12.1
N$24
  Top 0.305: 37.48,38.07 R35.2 38.72,35.27 39.7,34.29 SJ1.1
  Top 0.813: 37.48,38.07 R2.1
N$25
  Top 0.254: U3.P$5 19.93,18.28 21.35,19.7 C12.2
N$26
  Top 0.254: LED2.C 8.37,2.44 R14.1
N$27
  Top 0.254: LED5.C 6.25,46.24 R36.2
N$28
  Top 0.254: U3.P$21 13.75,16.27 13.53,16.12
  Top 0.61: JP5.1 10.29,4.78 10.29,12.88 13.53,16.12
N$29
  Top 0.254: U3.P$24 16.01,13.85 16,13.84
  Top 0.61: 16.01,13.85 16.01,4.71 JP5.2
N$30
  Top 0.254: U3.P$26 17.01,13.85 17.02,13.84
  Top 0.61: 17.01,13.85 17.01,5.09 JP6.1
N$31
  Top 0.254: U3.P$1 19.2,16.27 19.43,16.12
  Top 0.61: 19.43,16.12 22.86,12.7 22.86,3.94 JP6.2
N$32
  Top 0.254: U4.P$23 32.02,14.37 30.48,12.83 R18.2
N$33
  Top 0.254: U4.P$27 34.02,14.37 35.56,12.83 R19.2
N$34
  Top 0.254: U4.P$6 36.18,18.78 37.21,19.81 37.21,20.3 37.52,20.6 38.99,20.6 39.37,20.22 39.37,18.95 40.23,18.09 40.79,18.09 41.91,16.97 C19.1
N$35
  Top 0.254: U4.P$8 35.52,20.18 37.21,21.87 37.21,23.1 C20.1
N$36
  Top 0.254: R20.1 30.48,22.63 30.94,22.17 30.94,22.15 32.02,21.07 U4.P$13
N$37  (via drill 0.51)
  Top 0.254: U4.P$17 29.47,18.28 27.18,20.57 26.54,20.57 25.91,19.94 25.91,13.46 24.77,12.32 24.77,2.06 25.48,1.35 38.25,1.35 40.46,3.55 R17.2 v41.91,5.08
  Bottom 0.254: v41.91,5.08 TP3.P$1
N$38
  Top 0.254: U4.P$4 36.96,17.78 37.58,18.4 C18.1
N$39
  Top 0.254: U4.P$5 36.57,18.28 37.99,19.7 C18.2
N$40
  Top 0.254: R21.1 42.56,1.37 LED3.C
N$41
  Top 0.254: U4.P$21 30.38,16.28 30.1,16
  Top 0.61: 30.1,16 26.87,12.78 26.87,4.01 JP7.1
N$42
  Top 0.254: U4.P$24 32.52,13.85 32.51,13.84
  Top 0.61: 32.51,13.84 32.51,5.39 JP7.2
N$43
  Top 0.254: U4.P$26 33.52,13.85 33.53,13.84
  Top 0.61: 33.52,13.85 33.52,4.4 JP8.1
N$44
  Top 0.254: U4.P$1 35.71,16.28 35.97,16.12
  Top 0.61: 35.97,16.12 39.37,12.7 39.37,5.21 JP8.2
N$45
  Top 0.254: U5.P$23 34.02,51.8 35.56,53.34 R25.2
N$46
  Top 0.254: U5.P$27 32.02,51.8 30.48,53.34 R26.2
N$47
  Top 0.254: U5.P$6 29.86,47.26 27.94,45.34 25.3,45.34 24.13,46.51 C25.1
N$48
  Top 0.254: C26.1 29.21,44.45 30.48,45.72 31.38,45.72 U5.P$8
N$49
  Top 0.254: U5.P$13 34.02,45.1 34.29,44.83 34.67,44.83 35.56,43.94 R27.1
N$50  (via drill 0.51)
  Top 0.254: v40.64,49.53 43.36,52.25 R24.2 43.36,57.97 v43.31,57.91 | U5.P$17 37.15,47.76 v37.41,47.5
  Bottom 0.254: v37.41,47.5 38.61,47.5 v40.64,49.53 | TP2.P$1 42.04,59.18 v43.31,57.91
N$51
  Top 0.254: U5.P$4 27.29,48.26 C24.1
N$52
  Top 0.254: U5.P$5 28.71,47.76 27.29,46.34 C24.2
N$53
  Top 0.254: LED4.C 41.16,63.6 R28.1
N$54
  Top 0.254: U5.P$21 35.92,49.76 36.2,50.04
  Top 0.61: 36.2,50.04 39.37,53.09 39.37,61.14 JP14.1
N$55
  Top 0.254: U5.P$24 33.52,52.32 33.53,52.07
  Top 0.61: 33.52,52.32 33.52,61.33 JP14.2
N$56
  Top 0.254: U5.P$26 32.52,52.32 32.51,52.07
  Top 0.61: 32.52,52.32 32.52,60.37 31.24,61.65 JP15.1
N$57
  Top 0.254: 26.67,62.1 JP15.2 | U5.P$1 30.12,49.76 29.84,50.04
  Top 0.61: 26.67,62.1 26.67,53.21 29.84,50.04
RST1  (via drill 0.51)
  Top 0.254: U1.P$12 17.01,44.33 v17.65,43.69 17.78,43.56 R33.2
  Bottom 0.254: v17.65,43.69 17.65,39.62 19.81,37.47 37.85,37.47 38.48,38.1 41.66,38.1 45.34,41.78 45.34,45.09 46.61,46.35 46.61,47.88 JP16.6
RST2  (via drill 0.51)
  Top 0.254: U5.P$12 33.52,44.46 v34.29,43.69 R37.2 | JP19.6 49.53,50.8 46.99,50.8 v41.91,45.72
  Bottom 0.254: v34.29,43.69 34.34,43.69 34.92,43.1 39.29,43.1 v41.91,45.72
RST3  (via drill 0.51)
  Top 0.254: U3.P$12 16.01,22.09 v15.75,22.35 15.24,22.86 R44.2
  Bottom 0.254: v15.75,22.35 17.96,20.14 20.34,20.14 27.41,13.08 45.16,13.08 48.06,15.98 48.06,16.31 JP17.6
RST4  (via drill 0.51)
  Top 0.254: U4.P$12 32.52,21.73 v31.88,22.4 31.75,22.53 R48.2 | JP18.6 49.53,17.78 43.18,17.78 v40.64,20.32
  Bottom 0.254: v40.64,20.32 36.35,20.32 35.84,20.83 33.45,20.83 v31.88,22.4
SLP1  (via drill 0.51)
  Top 0.254: U1.P$14 18.91,45.86 20.32,44.45 20.32,43.81 v20.19,43.69 20.19,42.69 R34.2
  Bottom 0.254: v20.19,43.69 20.19,40.77 22.99,37.97 37.34,37.97 38.1,38.73 41.4,38.73 44.7,42.04 44.7,45.34 45.97,46.61 45.97,49.78 JP16.7
SLP2  (via drill 0.51)
  Top 0.254: U5.P$14 35.42,45.86 36.83,44.45 v36.83,44.09 R29.2 | JP19.7 49.53,53.34 46.99,53.34 41.91,48.26 v41.91,46.99
  Bottom 0.254: v41.91,46.99 39.01,44.09 v36.83,44.09
SLP3  (via drill 0.51)
  Top 0.254: U3.P$14 14.11,20.18 12.7,21.59 | 12.7,21.59 R15.2 | 12.7,21.59 v13.97,21.59
  Bottom 0.254: v13.97,21.59 16,19.58 20.17,19.58 27.23,12.52 47.07,12.52 JP17.7
SLP4  (via drill 0.51)
  Top 0.254: U4.P$14 30.01,20.18 29.01,21.18 29.01,21.59 | 29.01,21.59 29.01,23.28 R22.2 | v30.15,21.61 29.03,21.61 29.01,21.59 | JP18.7 49.53,15.24 44.45,15.24 v40.64,19.05
  Bottom 0.254: v40.64,19.05 36.83,19.05 35.56,20.32 31.45,20.32 v30.15,21.61
STP
  Bottom 0.254: SJ3.1 SJ2.1 SJ4.1 SJ5.1 55.06,42.73 JP22.8
STP1  (via drill 0.51)
  Top 0.254: JP16.1 41.66,36.83 v38.73,39.75 | LED1.A 5.97,64.77 5.21,64.01 5.21,57.28 6.6,55.88 v7.62,55.88 | U1.P$16 19.8,47.26 20.83,46.23 22.86,46.23 v22.89,46.25
  Bottom 0.254: v38.73,39.75 38.35,39.75 37.21,38.61 24.77,38.61 22.73,40.64 22.73,46.1 v22.89,46.25 22.86,46.28 22.86,46.99 18.67,51.18 8.76,51.18 7.62,52.32 v7.62,55.88 | SJ3.2 53.34,53.34 52.07,52.07 52.07,41.15 51.56,40.64 50.04,40.64 49.53,40.13 49.53,38.1 JP16.1
STP2  (via drill 0.51)
  Top 0.203: JP19.1 49.53,38.1 41.53,38.1
  Top 0.254: U5.P$16 36.34,47.26 36.34,47.23 v37.34,46.23 39.62,43.94 39.62,40.01 41.53,38.1 | LED4.A 43.18,64.77 45.72,62.23 45.72,53.34 v42.67,50.29
  Bottom 0.254: v37.34,46.23 38.61,46.23 v42.67,50.29 | SJ2.2 53.34,50.8 52.58,50.04 52.58,40.51 52.07,40.01 52.07,38.1 JP19.1
STP3  (via drill 0.51)
  Top 0.254: U3.P$16 13.09,18.78 13.09,18.79 v10.41,21.46 8.13,21.46 5.28,18.62 5.28,2.26 6.27,1.27 LED2.A
  Bottom 0.254: v10.41,21.46 10.85,21.46 13.44,24.05 20.45,24.05 28.68,15.82 42.7,15.82 44.2,17.32 44.2,25.15 JP17.1 49.53,27.94 52.07,27.94 52.2,28.07 52.2,36.96 52.58,37.34 52.58,39.75 53.09,40.26 53.09,47.88 53.47,48.26 SJ4.2
STP4  (via drill 0.51)
  Top 0.254: LED3.A 40.45,0.56 25.38,0.56 24.11,1.83 24.13,1.85 24.13,12.7 25.3,13.87 25.3,20.47 26.67,21.84 | U4.P$16 29.73,18.78 26.67,21.84 | 26.67,21.84 v26.67,24.13 | JP18.1 50.8,28.83 v52.45,27.18
  Bottom 0.254: JP18.1 49.53,30.48 43.18,30.48 38.1,25.4 31.75,25.4 30.48,24.13 v26.67,24.13 | v52.45,27.18 52.45,27.43 52.83,27.81 52.83,36.7 53.09,36.96 53.09,39.5 53.59,40.01 53.59,45.15 SJ5.2
VCC  (via drill 0.51)
  Top 0.203: U1.P$28 14.11,50.66 | U1.P$22 18.91,50.66 21.59,53.34
  Top 0.254: U4.P$28 35.42,15.38 36.83,13.97 C23.1 | U4.P$22 30.62,15.38 29.21,13.97 C22.1 28.82,13.35 28.63,13.16 | U5.P$28 30.62,50.66 29.21,52.07 C28.1 | U3.P$22 14.11,15.38 12.7,13.97 C17.1 | U3.P$28 18.91,15.38 20.32,13.97 C16.1 | U5.P$22 35.42,50.66 36.83,52.07 C29.1
  Top 0.305: C10.1 12.71,52.7
  Top 0.61: 20.69,13.35 C16.1
  Top 0.813: C11.1 20.94,52.69 21.59,53.34 v21.59,53.59 | C28.1 28.59,52.69 27.94,53.34 v27.94,53.59 | C29.1 37.45,52.69 38.1,53.34 v38.1,53.59 | v21.57,12.47 20.69,13.35 | C17.1 12.33,13.38 11.46,12.5 v11.46,12.47 | v27.99,11.12 27.99,12.52 28.63,13.16 | C23.1 37.3,13.35 38.05,12.6 38.05,11.05 v38.15,11.02
  Top 1.016: v4.57,53.59 v8.89,53.59 | C2.+ 13.78,28.77 v12.19,30.35 | C2.+ 24.96,28.77 26.67,30.48 F1.1 | C13.2 21.59,25.4 20.32,26.67 C2.+ | C10.1 12.18,52.69 11.4,53.47 v11.43,53.59 | v43.18,11.05 43.18,13.32 C19.2 | v24.77,53.59 24.77,52.7 24.13,51.94 C25.2 | D1.C 8,41.91 v8.64,41.27 v8.65,41.26 C7.2
  Bottom 0.254: 24.69,11.12 24.71,11.15 | 43.16,11.02 v43.18,11.05 | 8.38,41.4 8.51,41.27
  Bottom 0.813: 37.97,11.12 v38.15,11.02 | 12.06,30.48 v12.19,30.35 | 11.4,12.47 v11.46,12.47 11.53,12.5 11.4,12.47
  Bottom 1.016: v8.89,53.59 v11.43,53.59 v21.59,53.59 v24.77,53.59 v27.94,53.59 v38.1,53.59 | v38.15,11.02 43.16,11.02 | 37.97,11.12 v27.99,11.12 24.69,11.12 22.91,11.12 v21.57,12.47 v11.46,12.47 | 11.4,12.47 9.12,12.47 6.73,14.86 6.73,28.32 8.89,30.48 12.06,30.48 | v12.19,30.35 12.19,34.92 8.38,38.73 8.38,41.4 8.38,43.69 4.57,47.5 v4.57,53.59 | 8.51,41.27 v8.64,41.27
  pour Top (no thermals): 15.06,50.65 15.06,51.23 13.31,52.98 12.5,52.98 11.94,52.43 14.2,50.16 14.25,50.16 14.3,50.22 15.06,50.22
  pour Top (no thermals): 17.96,50.67 17.96,51.13 19.76,52.93 20.62,52.93 21.11,52.45 18.85,50.19 18.06,50.19 17.96,50.29
  pour Top (no thermals): 31.57,50.55 31.57,51.16 29.77,52.96 28.85,52.96 28.37,52.48 30.66,50.19 31.55,50.19 31.57,50.22
  pour Top (no thermals): 34.47,50.47 34.47,51.26 36.22,53.01 37.03,53.01 37.62,52.43 37.59,52.43 35.36,50.19 34.52,50.19 34.47,50.24
  pour Top (no thermals): 15.06,14.99 15.06,14.76 13.41,13.11 12.29,13.11 12.04,13.36 14.53,15.85 15.04,15.85 15.06,15.82
  pour Top (no thermals): 17.96,15.01 17.96,14.71 19.56,13.11 20.47,13.11 20.93,13.56 18.69,15.8 18.64,15.85 17.96,15.85
  pour Top (no thermals): 31.57,15.04 31.57,14.71 29.97,13.11 28.8,13.11 28.5,13.41 28.5,13.44 30.91,15.85 31.57,15.85
  pour Top (no thermals): 34.47,15.01 34.47,14.66 36.02,13.11 37.24,13.11 37.59,13.46 35.2,15.85 34.47,15.85
VIN
  Top 1.016: J1.VIN0 3.7,38.72 2.92,39.5 D1.A
  Top 1.27: JP21.1 6.1,36.43 J1.VIN0
VOUT  (via drill 0.51)
  Top 0.203: C27.1 36.83,41.29 R29.1 36.83,40.13 36.07,39.37 35.05,39.37 34.29,40.13 R37.1 | C21.1 27.94,23.51 R22.1 | 20.32,41.27 20.32,40.64 18.8,39.12 17.14,39.12 16.51,39.75 R8.1
  Top 0.254: R37.1 R40.1 R39.1 R38.1 30.48,38.99 | R33.1 R8.1 R31.1 R32.1 | R43.1 R42.1 R41.1 R44.1 15.24,25.53 v15.75,26.04 | R47.1 R46.1 R45.1 R48.1 31.75,26.67 | R10.3 9.07,7.44 v9,7.51 | R17.3 43.36,7.44 v43.29,7.51 41.91,8.89 41.91,12.7 38.75,15.86 R30.1 | R3.3 9.07,63.05 v9.53,63.5 | R24.3 41.06,60.11 v41.91,60.96 | U1.P$15 19.53,46.76 20.83,45.47 22.23,45.47 23.11,44.58 23.11,41.26 | R34.1 20.32,41.27 20.45,41.4 21.45,41.4 C9.1 23.11,41.26 | 23.11,41.26 24.4,41.26 24.89,40.77 | 24.89,40.77 26.67,38.99 30.48,38.99 | C27.1 38.1,44.08 U5.P$15 | 11.45,24.78 11.54,24.78 | 11.45,24.78 C15.1 4.81,24.78 v4.43,25.16 | 11.54,24.78 v11.43,24.77 11.45,24.78 | 11.54,24.78 R15.1 | U3.P$15 13.99,19.28 11.45,21.83 11.45,24.78 | U2.4 30.48,29.97 29.46,28.96 v30.5,28.22 30.48,26.8 | U4.P$15 30.12,19.28 27.94,21.46 C21.1 | R22.1 29.21,26.67 | v31.77,32.03 31.75,38.1 30.86,38.99 30.48,38.99 | 24.89,40.77 v25.53,41.4 | R9.1 26.02,49.69 v25.91,49.58 | R23.1 v23.51,27.24 v23.5,27.25 | 9.4,50.69 R16.1 6.93,50.8 v6.2,51.54 5.08,50.42 LED5.A
  Top 0.305: 40.01,29.86 C4.1 | 40.01,29.86 C1.1 | 40.01,30.48 40.01,29.86
  Top 0.406: v31.77,32.03 31.88,31.88 C3.A
  Top 0.61: C3.A 36.83,33.02 37.48,33.67 R1.2 | U2.4 v30.5,30.76 v31.77,32.03
  Top 1.27: v31.77,32.03 40.01,31.75 | 40.01,31.75 40.01,30.48 40.01,30.35 | 40.01,31.75 JP4.1 JP4.2 JP22.4
  Bottom 0.254: v9,7.51 v43.29,7.51 | v41.91,60.96 41.91,63.5 40.64,64.77 10.79,64.77 v9.53,63.5 6.35,63.5 1.27,58.42 1.27,55.24 | v11.43,24.77 11.54,24.78 11.45,24.78 11.45,25.92 12.7,27.18 15.82,27.18 | 1.27,52.58 1.27,27.94 4.05,25.16 v4.43,25.16 4.28,25.01 4.28,8.89 5.55,7.62 8.89,7.62 v9,7.51 | 1.27,52.58 1.27,55.24 | 15.82,27.18 22.07,27.18 v22.12,27.23 | v15.75,26.04 15.75,27.1 15.82,27.18 | v9,7.51 8.98,7.53 | 1.27,52.58 1.29,52.55 | v25.91,49.58 25.91,41.78 v25.53,41.4 | v6.2,51.54 6.2,51.59 5.97,51.82 5.97,54.1 4.83,55.24 1.27,55.24
  other vias: 30.51,32.03 33.05,32.03 31.78,30.76 33.05,30.76 30.51,29.49 31.78,29.49 33.05,29.49 31.78,28.22 33.05,28.22 24.77,27.25 26.06,27.25 27.3,28.57 27.33,27.28 28.57,28.57 28.6,27.28
  pour Bottom (isolate 0.305, no thermals): 34.26,33.68 21.01,33.68 20.32,32.99 20.32,27.41 21.06,26.67 34.09,26.67 34.8,27.38 34.8,33.15
  pour Top (isolate 0.305, no thermals): 34.29,33.71 29.44,33.71 27.97,32.23 27.97,30.58 25.35,27.97 21.51,27.97 21.51,26.67 34.11,26.67 34.8,27.36 34.8,33.2

### Text on the board
Bottom: 2-15-11
bPlace: Bus | Enable | 1 | 2 | 3 | 4 | STP | VIN | GND | DIR | 1 | 2 | 3 | 4 | Bus | Enable
tValues: Barrel Jack